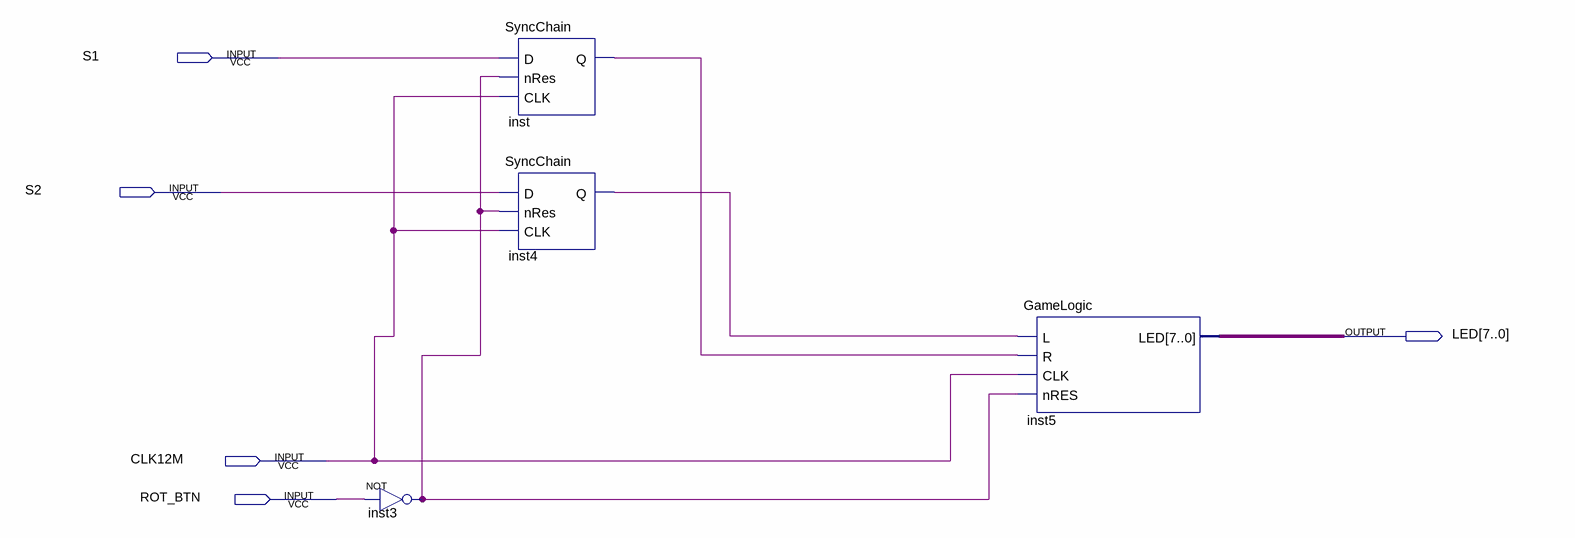
[diagram p0: schematic sheet]
// Quartus schematic FasterWins.bdf as structural Verilog: 4 symbols, 5 pins
module FasterWins (
  input  S1,
  input  S2,
  input  CLK12M,
  input  ROT_BTN,
  output [7:0] LED
);

  wire inst3_out, inst4_q, inst_q;

  not inst3 (inst3_out, ROT_BTN);
  SyncChain inst (.D(S1), .nRes(inst3_out), .CLK(CLK12M), .Q(inst_q));
  SyncChain inst4 (.D(S2), .nRes(inst3_out), .CLK(CLK12M), .Q(inst4_q));
  GameLogic inst5 (.L(inst4_q), .R(inst_q), .CLK(CLK12M), .nRES(inst3_out), .LED(LED));
endmodule
